# EAGLE design IFB-40003-R02 - I2C_Buttons (EAGLE 9.6.2)
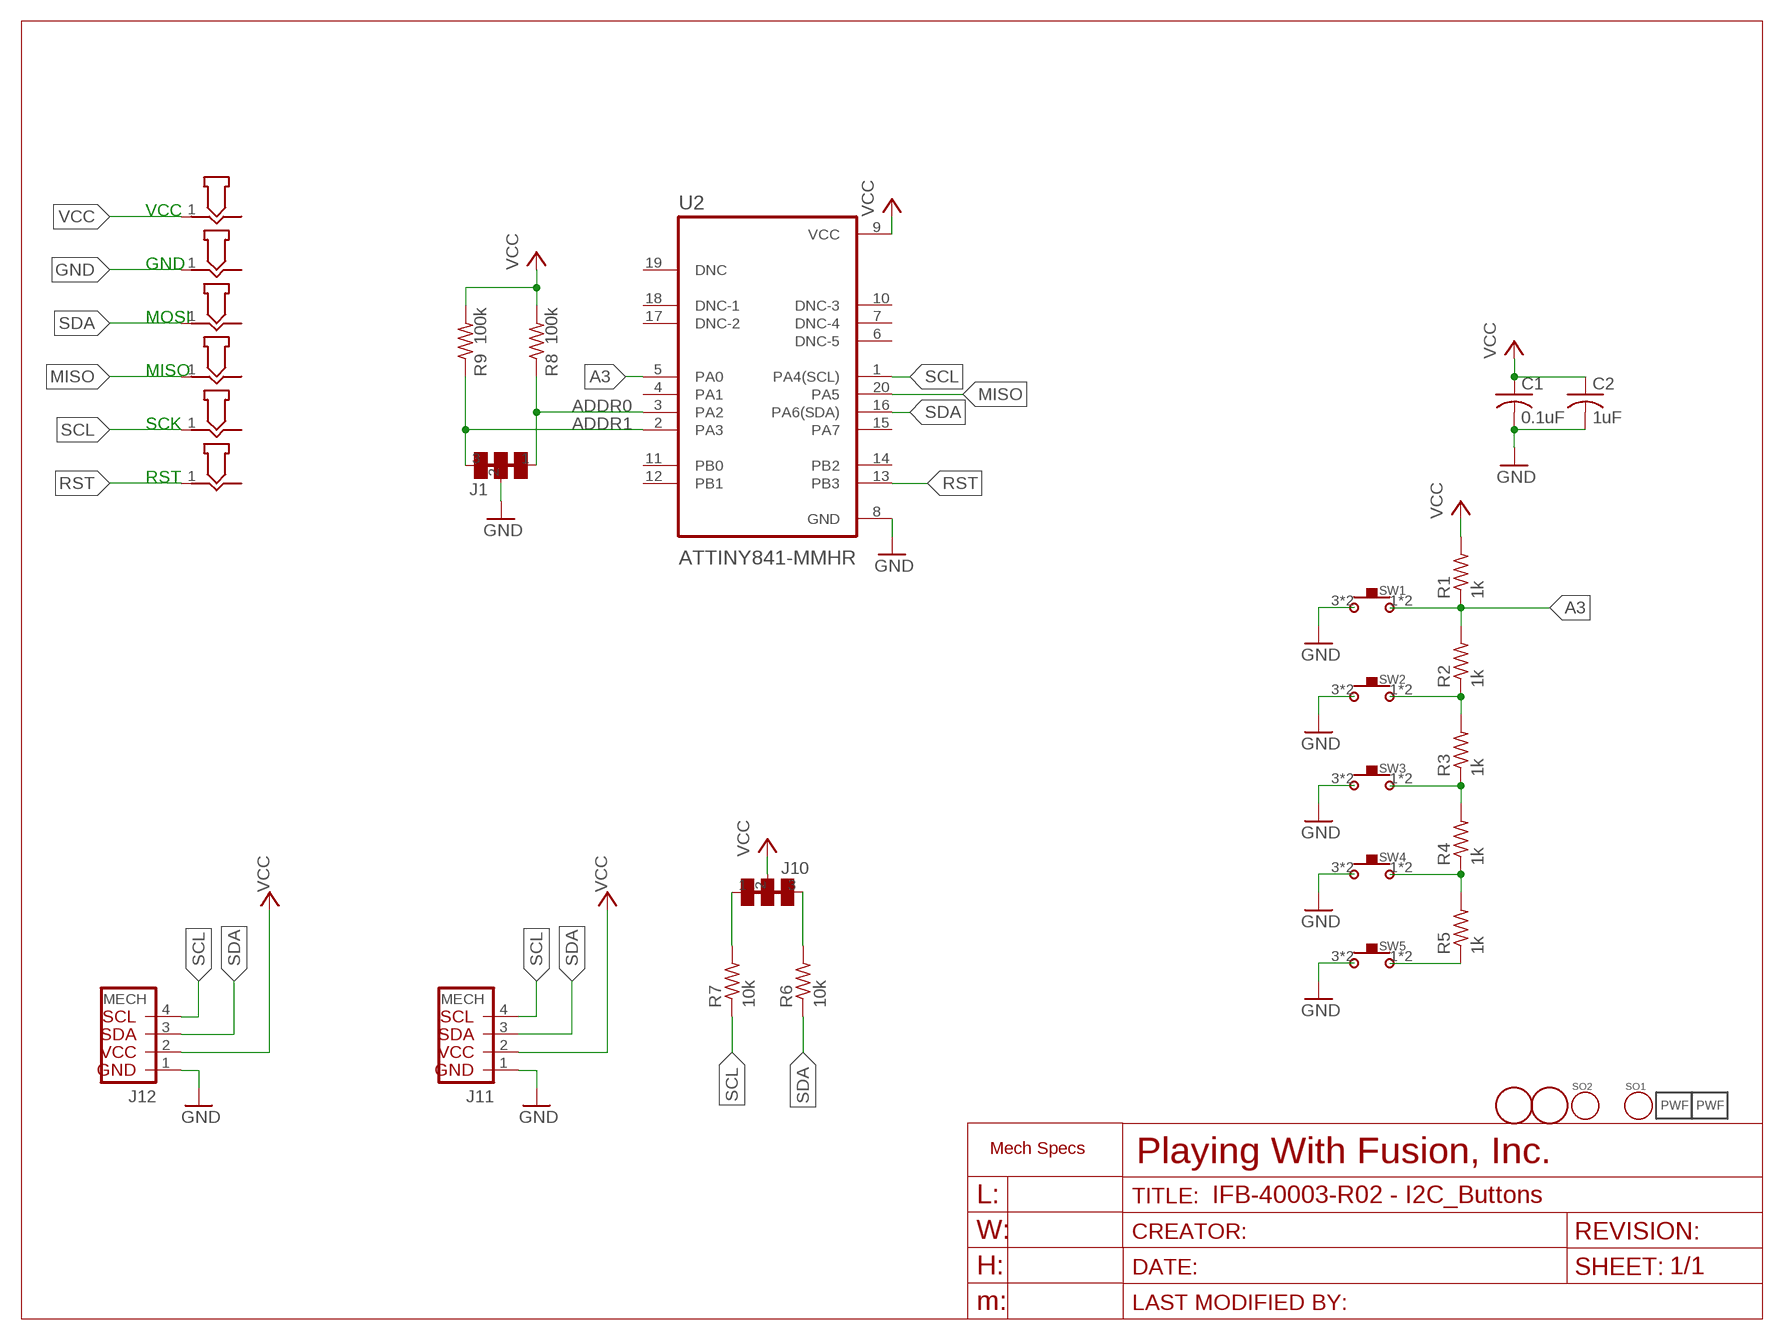
[diagram p0: schematic, sheet 1]

## Parts
C1  0.1uF  C-USC0603K  [C0603K]
C2  1uF  C-USC0603K  [C0603K]
J1  CUT_JUMPER_2X  [SMT_2X_CUTTABLE_JUMPER]
J4  POGO_PAD  [P50_POGO_BOARD_CONTACT_12MIL]
J5  POGO_PAD  [P50_POGO_BOARD_CONTACT_12MIL]
J6  POGO_PAD  [P50_POGO_BOARD_CONTACT_12MIL]
J7  POGO_PAD  [P50_POGO_BOARD_CONTACT_12MIL]
J8  POGO_PAD  [P50_POGO_BOARD_CONTACT_12MIL]
J9  POGO_PAD  [P50_POGO_BOARD_CONTACT_12MIL]
J10  CUT_JUMPER_2X  [SMT_2X_CUTTABLE_JUMPER]
J11  QWIICSIDE  [SM04B-SRSS-TB]
J12  QWIICSIDE  [SM04B-SRSS-TB]
LOGO1  PWF_LOGOPWF-6MM-SS  [LOGO_6MM_STEIN]
LOGO2  PWF_LOGOPWF-12MM-SS  [LOGO_12MM_STEIN]
R1  1k  R-US_R0603  [R0603]
R2  1k  R-US_R0603  [R0603]
R3  1k  R-US_R0603  [R0603]
R4  1k  R-US_R0603  [R0603]
R5  1k  R-US_R0603  [R0603]
R6  10k  R-US_R0603  [R0603]
R7  10k  R-US_R0603  [R0603]
R8  100k  R-US_R0603  [R0603]
R9  100k  R-US_R0603  [R0603]
SO1  STAND_OFFNO4_TIGHT  [STANDOFF_NO4_TIGHT]
SO2  STAND_OFFNO4_TIGHT  [STANDOFF_NO4_TIGHT]
SW1  PTS6455MM  [PTS645_5MM]
SW2  PTS6455MM  [PTS645_5MM]
SW3  PTS6455MM  [PTS645_5MM]
SW4  PTS6455MM  [PTS645_5MM]
SW5  PTS6455MM  [PTS645_5MM]
U2  ATTINY841-MMHR  [QFN45P300X300X85-21N]
U$2  FIDUCIAL  [FIDUCIAL_1MM]
U$3  FIDUCIAL  [FIDUCIAL_1MM]

## Nets
A3: R1.1 R2.2 SW1.1 SW1.2 U2.5(PA0)
ADDR0: J1.1 R8.1 U2.3(PA2)
ADDR1: J1.3 R9.1 U2.2(PA3)
GND: C1.2 C2.2 J1.2 J5.1 J11.1 J12.1 SW1.3 SW1.4 SW2.3 SW2.4 SW3.3 SW3.4 SW4.3 SW4.4 SW5.3 SW5.4 U2.8(GND)
MISO: J7.1 U2.20(PA5)
N$2: R2.1 R3.2 SW2.1 SW2.2
N$3: R3.1 R4.2 SW3.1 SW3.2
N$4: R4.1 R5.2 SW4.1 SW4.2
N$5: R5.1 SW5.1 SW5.2
N$6: J10.1 R7.2
N$7: J10.3 R6.2
RST: J9.1 U2.13(PB3)
SCL: J8.1 J11.4 J12.4 R7.1 U2.1(PA4(SCL))
SDA: J6.1 J11.3 J12.3 R6.1 U2.16(PA6(SDA))
VCC: C1.1 C2.1 J4.1 J10.2 J11.2 J12.2 R1.2 R8.2 R9.2 U2.9(VCC)
Unconnected: J11.MECH1(MECH) J11.MECH2(MECH) J12.MECH1(MECH) J12.MECH2(MECH) U2.4(PA1) U2.6(DNC-5) U2.7(DNC-4) U2.10(DNC-3) U2.11(PB0) U2.12(PB1) U2.14(PB2) U2.15(PA7) U2.17(DNC-2) U2.18(DNC-1) U2.19(DNC)

## Notes on the sheet
- VCC
- GND
- MOSI
- MISO
- SCK
- RST

## Library data of the parts
C1 C2 = rcl:C-US: CAPACITOR, American symbol; SPICEPREFIX: C
J1 J10 = PlayingWithFusion_Breakout-Lib:CUT_JUMPER_2X
J4-J9 = PlayingWithFusion_Breakout-Lib:POGO_PAD
J11 J12 = PlayingWithFusion_JST:QWIIC
LOGO1 LOGO2 = PlayingWithFusion_Logo:PWF_LOGO
R1-R9 = rcl:R-US_: RESISTOR, American symbol; SPICEPREFIX: R
SO1 SO2 = PlayingWithFusion_Breakout-Lib:STAND_OFF: Stand Off This is the mechanical footprint for a #4 phillips button head screw. Use the keepout ring to avoid running the screw head into surrounding components. SKU : PRT-00447
SW1-SW5 = PlayingWithFusion_CandK:PTS645
U2 = ATTINY841-MMHR:ATTINY841-MMHR: None Check availability <https://pricing.snapeda.com/parts/ATTINY841-MMHR/Microchip/view-part?ref=eda>; AVAILABILITY: In Stock; DESCRIPTION: AVR AVR® ATtiny Microcontroller IC 8-Bit 16MHz 8KB (8K x 8) FLASH 20-VQFN (3x3); MF: Microchip; MP: ATTINY841-MMHR; PACKAGE: DFN-20 Microchip; PRICE: None; PURCHASE-URL: https://pricing.snapeda.com/search/part/ATTINY841-MMHR/?ref=eda
U$2 U$3 = PlayingWithFusion_Breakout-Lib:FIDUCIAL: For use by pick and place machines to calibrate the vision/machine, 1mm By microbuilder.eu

## Board
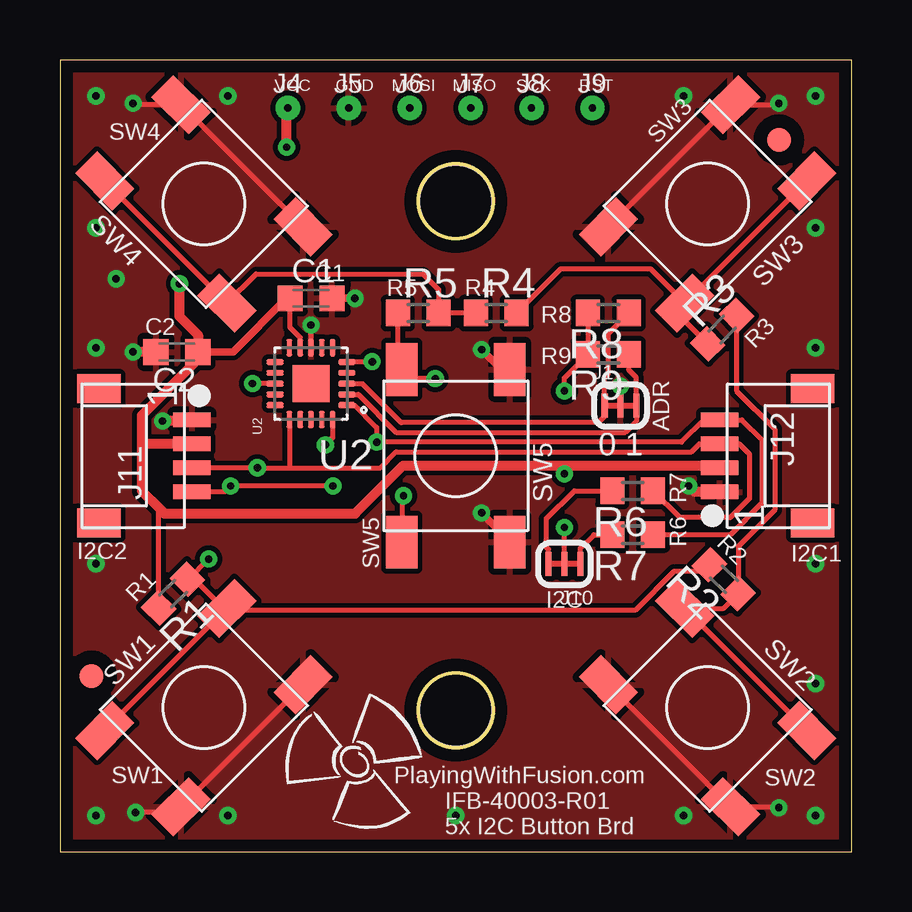
[diagram p1: board, top side]
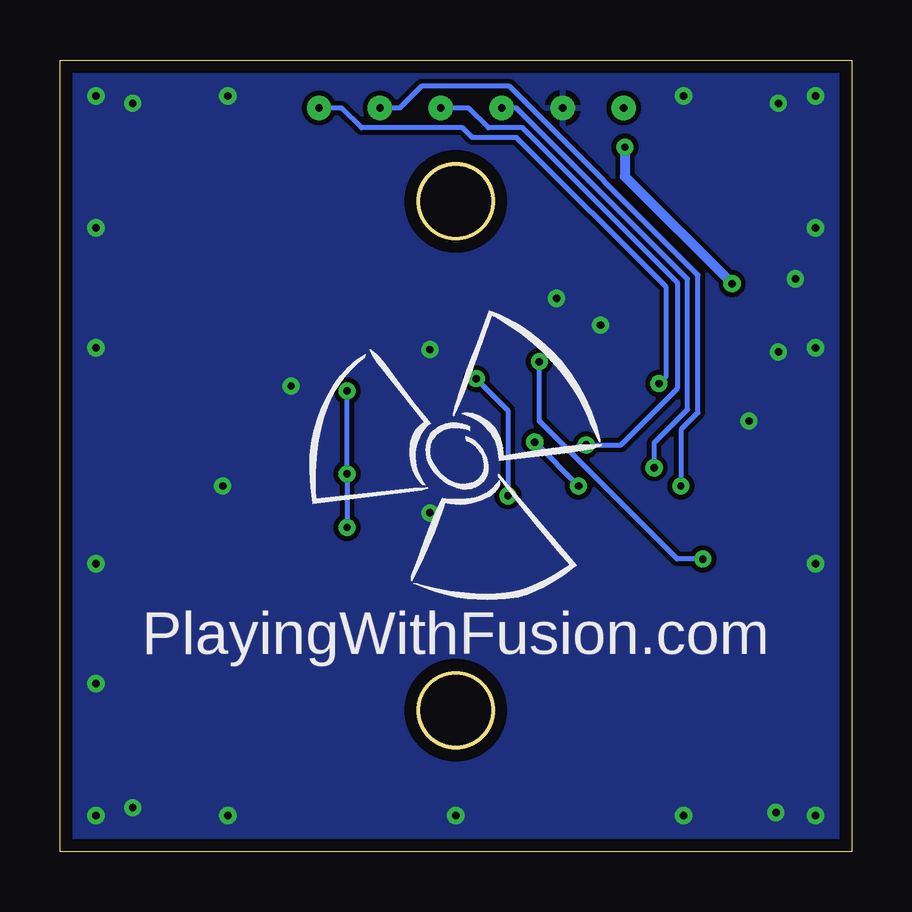
[diagram p2: board, bottom side, seen from below]

Size 33 x 33 mm. Coordinates in mm from the lower left corner, seen from the top.
Outline: 0,33 0,0 33,0 33,33 0,33
Outline: circle at 16.5,5.89 radius 1.55
Outline: circle at 16.5,27.11 radius 1.55
Copper layers (1*16): Top 0.035mm / dielectric 1.5mm / Bottom 0.035mm
Design rules "default *": minimum track width 8mil, minimum drill 12mil, track to track 8mil, track to pad 8mil, pad to pad 8mil, via to via 8mil, smd to smd 8mil, copper to edge 20mil, drill to drill 6mil, minimum pad ring 10mil, minimum via ring 8mil, stop-mask expansion 4mil, vias tented up to drill 17mil, thermal gap 10mil
Holes 3.05 mm at 16.5,5.89 16.5,27.11

### Footprints (pad centres in the part's own frame; a part is rotated, then mirrored left to right if it is on the bottom)
C0603K = smd 1.05 x 1.08: 1 -0.875,0; 2 0.875,0
SMT_2X_CUTTABLE_JUMPER = smd 0.254 x 1.016: 1 -0.66,0; 2 0,0; 3 0.66,0
P50_POGO_BOARD_CONTACT_12MIL = drill 0.305 pad 1.016: 1 0,0
SM04B-SRSS-TB = smd 0.6 x 1.55: 1 1.5,0; 2 0.5,0; 3 -0.5,0; 4 -1.5,0 | smd 1.2 x 1.8: MECH1 2.8,3.875; MECH2 -2.8,3.875
R0603 = smd 1 x 1.1: 1 -0.85,0; 2 0.85,0
STANDOFF_NO4_TIGHT = hole 3.048: 0,0
PTS645_5MM = smd 2.2 x 1.3: 1 -3.6,2.25; 2 3.6,2.25; 3 -3.6,-2.25; 4 3.6,-2.25
QFN45P300X300X85-21N = smd 0.72 x 0.24: 1 -1.495,0.9; 2 -1.495,0.45; 3 -1.495,0; 4 -1.495,-0.45; 5 -1.495,-0.9; 11 1.495,-0.9; 12 1.495,-0.45; 13 1.495,0; 14 1.495,0.45; 15 1.495,0.9 | smd 0.24 x 0.72: 6 -0.9,-1.495; 7 -0.45,-1.495; 8 0,-1.495; 9 0.45,-1.495; 10 0.9,-1.495; 16 0.9,1.495; 17 0.45,1.495; 18 0,1.495; 19 -0.45,1.495; 20 -0.9,1.495 | smd 1.55 x 1.55: 21 0,0
FIDUCIAL_1MM = smd 1 x 1: 1 0,0

### Placement (x,y rotation side)
C1  10.46,23.06 0 top
C2  4.88,20.83 180 top
J1  23.37,18.59 0 top
J4  9.5,31 0 top
J5  12.04,31 0 top
J6  14.58,31 0 top
J7  17.12,31 0 top
J8  19.66,31 0 top
J9  22.2,31 0 top
J10  21.03,11.99 180 top
J11  5.5,16.5 90 top
J12  27.5,16.5 270 top
LOGO1  12.25,3.76 0 top
LOGO2  16.51,16.51 0 bottom
R1  4.72,10.75 225 top
R2  27.68,11.35 135 top
R3  27.6,21.76 45 top
R4  18.19,22.45 0 top
R5  14.94,22.45 0 top
R6  23.88,15.04 180 top
R7  23.88,13.21 180 top
R8  22.86,22.45 180 top
R9  22.86,20.73 180 top
SO1  16.5,5.89 0 top
SO2  16.5,27.11 0 top
SW1  6,6 45 top
SW2  27,6 315 top
SW3  27,27 225 top
SW4  6,27 135 top
SW5  16.5,16.5 90 top
U2  10.46,19.51 180 top
U$2  29.97,29.67 0 top
U$3  1.32,7.32 0 top

### Tracks (layer width: path | path; a pad name or v marks a point on that pad's centre or on a via)
A3  (via drill 0.3)
  Top 0.203: SW1.1 6.89,10.07 | 6.89,10.07 SW1.2 7.03,10.06 23.98,10.06 25.6,11.68 26.8,11.68 R2.2 | 6.89,10.07 5.62,11.35 R1.1 5.36,11.35 v6.2,12.19 | v13.02,20.42 13,20.41 U2.5
  Bottom 0.203: v6.2,12.19 7.26,12.19 13.02,17.95 v13.02,20.42
ADDR0
  Top 0.203: U2.3 12.6,19.51 14.22,17.88 22.45,17.88 22.71,18.14 J1.1 22.71,19.76 22.86,19.91 22.86,21.6 R8.1
ADDR1
  Top 0.203: R9.1 23.71,20.08 24.03,19.76 J1.3 24.03,17.93 23.57,17.48 14.02,17.48 12.44,19.06 U2.2
GND  (via drill 0.3)
  Top 0.203: SW4.3 SW4.4 3.1,31.14 v3.05,31.19 | SW3.4 SW3.3 29.92,31.14 v29.97,31.19 | SW2.3 SW2.4 29.94,1.86 v29.97,1.83 | SW1.4 SW1.3 4.81,1.63 v3.15,1.63 | U2.8 v10.46,21.95 | J1.2 v23.37,19.41
  Top 0.305: SW5.4 18.41,20.1 v17.58,20.93 | SW5.3 18.75,12.95 v17.58,14.12 | C1.2 v12.29,23.06
  Top 0.406: 27.99,14.99 J12.1 26.45,15 v26.21,15.24 | C2.2 v3.05,20.83 | J11.1 5.45,17.95 v4.28,17.95
  other vias: 2.34,23.88 7,1.5 26,1.5 31.5,7 31.5,12 31.5,21 31.5,26 26,31.5 7,31.5 1.5,26 1.5,31.5 31.5,31.5 31.5,1.5 1.5,1.5 1.5,12 1.5,21 16.5,1.5
  pour Bottom: 0,33 0,0 33,0 33,33
  pour Top: 33,0 0,0 0,33 33,33
MISO  (via drill 0.3)
  Top 0.203: U2.20 11.37,17.26 v11.06,16.96
  Bottom 0.203: J7.1 15.96,31 15.14,30.18 13.72,30.18 7.24,23.7 7.24,19.33 9.61,16.96 v11.06,16.96
N$2
  Top 0.203: SW2.2 SW2.1 27.66,10.14 R2.1 28.28,12.72 29.79,14.24 29.79,17.61 28.2,19.2 R3.2
N$3
  Top 0.203: SW3.1 SW3.2 | SW3.2 26.05,22.11 R3.1 | SW3.2 24.63,24.28 20.86,24.28 R4.2
N$4
  Top 0.203: SW4.2 SW4.1 8.17,24.08 15.14,24.08 15.79,23.43 R5.2 R4.1
N$5  (via drill 0.3)
  Top 0.203: v15.65,19.71 14.25,19.71 SW5.2 14.09,20.27 R5.1 | v14.33,14.83 14.25,14.76 SW5.1
  Bottom 0.203: v15.65,19.71 14.33,18.39 v14.33,14.83
N$6
  Top 0.203: J10.1 21.69,12.65 22.25,13.21 R7.2
N$7
  Top 0.203: 23.02,15.04 R6.2 21.44,15.04 20.27,13.87 20.27,12.7 20.37,12.6 J10.3
RST  (via drill 0.3)
  Top 0.203: U2.13 v8.03,19.51
  Bottom 0.203: v8.03,19.51 7.72,19.81 7.72,23.53 13.96,29.77 15.8,29.77 16.21,30.18 20.44,30.18 21.26,31 J9.1
SCL  (via drill 0.3)
  Top 0.203: U2.1 12.28,18.61 13.21,17.68 v13.21,17.07 25.91,17.07 26.84,18 J12.4 28.43,18 29.26,17.17 29.26,14.53 27.94,13.21 R7.1 | v11.38,15.24 v7.11,15.24 6.87,15 J11.4
  Bottom 0.203: J8.1 18.84,31 17.93,31.9 14.27,31.9 6.4,24.04 6.4,18.3 7.11,17.58 v7.11,15.24 | v13.21,17.07 v11.38,15.24
SDA  (via drill 0.3)
  Top 0.203: 9.55,16 v8.23,16 J11.3 | 9.55,16 13.36,16 14.02,16.66 26.31,16.66 26.65,17 J12.3 28.31,17 28.75,16.56 28.75,14.73 27.94,13.92 25.84,13.92 R6.1 | 9.55,16 9.56,16.01 U2.16
  Bottom 0.203: J6.1 13.97,31 6.83,23.87 6.83,18.43 8.23,17.04 v8.23,16
VCC  (via drill 0.3)
  Top 0.203: R1.2 4.12,14.25 4.16,14.29 | 21.03,16.09 v21.03,15.75 | C1.1 9.59,21.85 10.02,21.43 U2.9 | J10.2 v21.03,13.51 | v21.03,19.2 21.03,19.75 R9.2 R8.2
  Top 0.305: 23.03,16.05 23.06,16.09 | C1.1 9.45,23.06 7.21,20.83 C2.1
  Top 0.406: J12.2 27.91,16.09 23.06,16.09 21.03,16.09 14.3,16.09 12.3,14.09 4.36,14.09 4.16,14.29 3.41,15.04 3.41,16.87 | 3.41,16.87 3.41,18.18 5.75,20.52 C2.1 5.75,21.54 4.98,22.31 v4.98,23.67 | J11.2 3.54,17 3.41,16.87 | v9.45,29.36 9.45,30.95 J4.1
  Bottom 0.203: v21.03,13.51 v21.03,15.75 v21.03,19.2
  Bottom 0.406: v9.45,29.36 9.45,28.14 v4.98,23.67

### Text on the board
tPlace: VCC | GND | MOSI | MISO | SCK | RST | SW4 | SW3 | C1 | R5 | R4 | R8 | C2 | R9 | R3 | ADR | U2 | 0 1 | R7 | R6 | R2 | I2C2 | SW5 | I2C1 | I2C | R1 | SW1 | PlayingWithFusion.com | SW2 | IFB-40003-R01 / 5x I2C Button Brd
bPlace: PlayingWithFusion.com